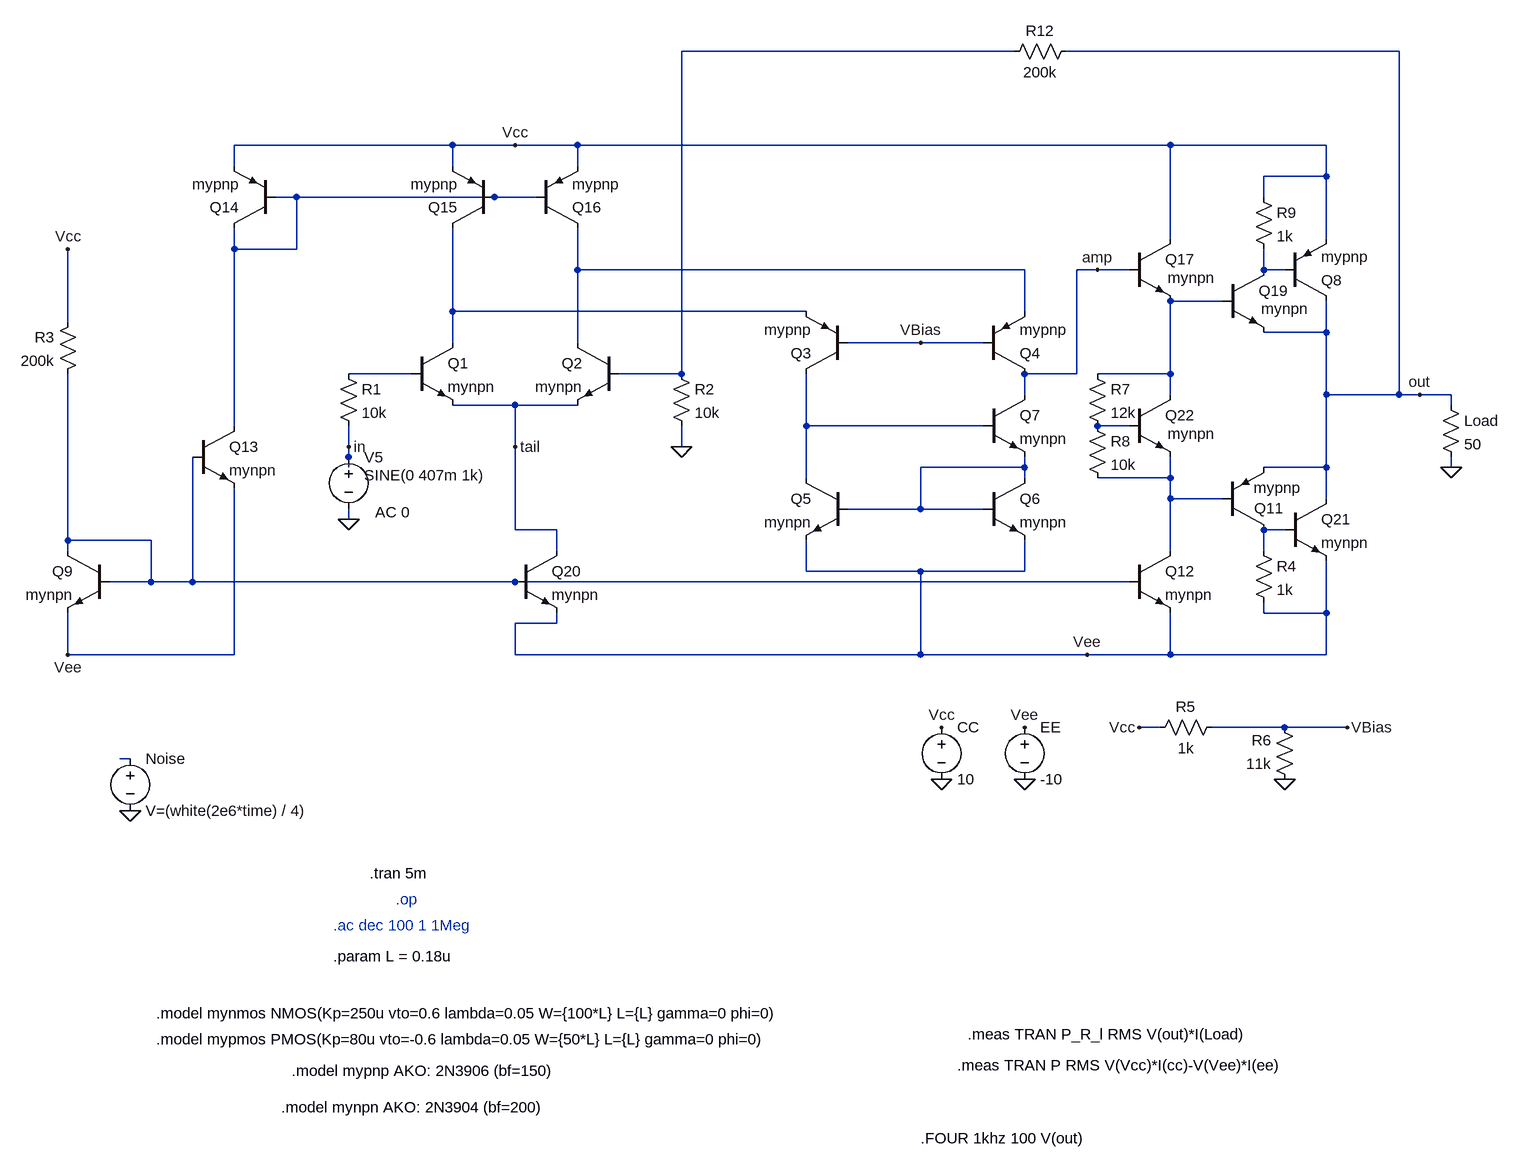
[diagram p0: schematic Ph2.asc]
Ph2.asc, the LTspice schematic file:
Version 4.1
SHEET 1 2180 1464
WIRE 1248 -464 736 -464
WIRE 1840 -464 1328 -464
WIRE 384 -320 48 -320
WIRE 480 -320 384 -320
WIRE 576 -320 480 -320
WIRE 1488 -320 576 -320
WIRE 1728 -320 1488 -320
WIRE 48 -288 48 -320
WIRE 384 -288 384 -320
WIRE 576 -288 576 -320
WIRE 1728 -272 1728 -320
WIRE 1728 -272 1632 -272
WIRE 144 -240 112 -240
WIRE 448 -240 144 -240
WIRE 512 -240 448 -240
WIRE 1632 -240 1632 -272
WIRE 1488 -176 1488 -320
WIRE 1728 -176 1728 -272
WIRE 48 -160 48 -192
WIRE 144 -160 144 -240
WIRE 144 -160 48 -160
WIRE 576 -128 576 -192
WIRE 1264 -128 576 -128
WIRE 1376 -128 1344 -128
WIRE 1424 -128 1376 -128
WIRE 1632 -128 1632 -160
WIRE 1664 -128 1632 -128
WIRE 1568 -80 1488 -80
WIRE 384 -64 384 -192
WIRE 928 -64 384 -64
WIRE 1264 -64 1264 -128
WIRE -208 -48 -208 -160
WIRE 1728 -32 1728 -80
WIRE 1728 -32 1632 -32
WIRE 384 -16 384 -64
WIRE 576 -16 576 -128
WIRE 1104 -16 992 -16
WIRE 1200 -16 1104 -16
WIRE 320 32 224 32
WIRE 736 32 736 -464
WIRE 736 32 640 32
WIRE 1344 32 1344 -128
WIRE 1344 32 1264 32
WIRE 1488 32 1488 -80
WIRE 1488 32 1376 32
WIRE 1264 64 1264 32
WIRE 1488 64 1488 32
WIRE 1728 64 1728 -32
WIRE 1840 64 1840 -464
WIRE 1840 64 1728 64
WIRE 1872 64 1840 64
WIRE 1920 64 1872 64
WIRE 480 80 384 80
WIRE 576 80 480 80
WIRE 1920 80 1920 64
WIRE 48 112 48 -160
WIRE 928 112 928 32
WIRE 1200 112 928 112
WIRE 1424 112 1376 112
WIRE 224 144 224 112
WIRE 480 144 480 80
WIRE 736 144 736 112
WIRE 224 160 224 144
WIRE 224 176 224 160
WIRE 1264 176 1264 160
WIRE 1264 176 1104 176
WIRE 1728 176 1728 64
WIRE 1728 176 1632 176
WIRE 1920 176 1920 160
WIRE 928 192 928 112
WIRE 1264 192 1264 176
WIRE 1488 192 1488 160
WIRE 1488 192 1376 192
WIRE 1488 224 1488 192
WIRE 1568 224 1488 224
WIRE 1728 224 1728 176
WIRE 1104 240 1104 176
WIRE 1104 240 992 240
WIRE 1200 240 1104 240
WIRE 224 256 224 240
WIRE 480 272 480 144
WIRE 544 272 480 272
WIRE 1664 272 1632 272
WIRE -208 288 -208 32
WIRE -80 288 -208 288
WIRE -208 304 -208 288
WIRE 544 304 544 272
WIRE 1488 304 1488 224
WIRE 1632 304 1632 272
WIRE 928 336 928 288
WIRE 1104 336 928 336
WIRE 1264 336 1264 288
WIRE 1264 336 1104 336
WIRE -80 352 -80 288
WIRE -80 352 -144 352
WIRE -16 352 -16 160
WIRE -16 352 -80 352
WIRE 480 352 -16 352
WIRE 1424 352 480 352
WIRE 1632 400 1632 384
WIRE 1728 400 1728 320
WIRE 1728 400 1632 400
WIRE 544 416 544 400
WIRE 544 416 480 416
WIRE -208 464 -208 400
WIRE 48 464 48 208
WIRE 48 464 -208 464
WIRE 480 464 480 416
WIRE 1104 464 1104 336
WIRE 1104 464 480 464
WIRE 1360 464 1104 464
WIRE 1488 464 1488 400
WIRE 1488 464 1360 464
WIRE 1728 464 1728 400
WIRE 1728 464 1488 464
WIRE 1472 576 1440 576
WIRE 1664 576 1552 576
WIRE 1760 576 1664 576
WIRE -112 624 -128 624
FLAG 1136 656 0
FLAG 1264 656 0
FLAG 1136 576 Vcc
FLAG 1264 576 Vee
FLAG 224 256 0
FLAG 480 -320 Vcc
FLAG 1920 176 0
FLAG 1872 64 out
FLAG 1360 464 Vee
FLAG -208 464 Vee
FLAG -208 -160 Vcc
FLAG 1664 656 0
FLAG 1440 576 Vcc
FLAG 1760 576 VBias
FLAG 1104 -16 VBias
FLAG 736 144 0
FLAG 224 144 in
FLAG 480 144 tail
FLAG 1376 -128 amp
FLAG -112 704 0
SYMBOL voltage 1136 560 R0
WINDOW 123 0 0 Left 0
WINDOW 39 0 0 Left 0
SYMATTR InstName CC
SYMATTR Value 10
SYMBOL voltage 1264 560 R0
WINDOW 123 0 0 Left 0
WINDOW 39 0 0 Left 0
SYMATTR InstName EE
SYMATTR Value -10
SYMBOL res 208 16 R0
SYMATTR InstName R1
SYMATTR Value 10k
SYMBOL npn 320 -16 R0
SYMATTR InstName Q1
SYMATTR Value mynpn
SYMBOL npn 640 -16 M0
SYMATTR InstName Q2
SYMATTR Value mynpn
SYMBOL res 720 16 R0
SYMATTR InstName R2
SYMATTR Value 10k
SYMBOL pnp 992 32 R180
SYMATTR InstName Q3
SYMATTR Value mypnp
SYMBOL pnp 1200 32 M180
SYMATTR InstName Q4
SYMATTR Value mypnp
SYMBOL npn 992 192 M0
SYMATTR InstName Q5
SYMATTR Value mynpn
SYMBOL npn 1200 192 R0
SYMATTR InstName Q6
SYMATTR Value mynpn
SYMBOL npn 1200 64 R0
SYMATTR InstName Q7
SYMATTR Value mynpn
SYMBOL res 1904 64 R0
SYMATTR InstName Load
SYMATTR Value 50
SYMBOL npn -144 304 M0
SYMATTR InstName Q9
SYMATTR Value mynpn
SYMBOL res -192 -64 M0
SYMATTR InstName R3
SYMATTR Value 200k
SYMBOL npn 1424 304 R0
SYMATTR InstName Q12
SYMATTR Value mynpn
SYMBOL npn -16 112 R0
SYMATTR InstName Q13
SYMATTR Value mynpn
SYMBOL pnp 112 -192 R180
WINDOW 123 84 4 Left 2
SYMATTR InstName Q14
SYMATTR Value mypnp
SYMBOL pnp 448 -192 R180
WINDOW 123 84 4 Left 2
SYMATTR InstName Q15
SYMATTR Value mypnp
SYMBOL pnp 512 -192 M180
WINDOW 123 84 4 Left 2
SYMATTR InstName Q16
SYMATTR Value mypnp
SYMBOL npn 480 304 R0
SYMATTR InstName Q20
SYMATTR Value mynpn
SYMBOL voltage 224 144 R0
WINDOW 3 24 44 Left 2
WINDOW 123 41 101 Left 2
WINDOW 39 0 0 Left 0
SYMATTR Value SINE(0 407m 1k)
SYMATTR Value2 AC 0
SYMATTR InstName V5
SYMBOL res 1568 560 R90
WINDOW 0 0 56 VBottom 2
WINDOW 3 32 56 VTop 2
SYMATTR InstName R5
SYMATTR Value 1k
SYMBOL res 1680 672 R180
WINDOW 0 36 76 Left 2
WINDOW 3 36 40 Left 2
SYMATTR InstName R6
SYMATTR Value 11k
SYMBOL npn 1568 -128 R0
WINDOW 3 60 60 Left 2
SYMATTR Value mynpn
SYMATTR InstName Q19
SYMBOL pnp 1664 -80 M180
SYMATTR InstName Q8
SYMATTR Value mypnp
SYMBOL pnp 1568 272 M180
WINDOW 0 49 33 Left 2
WINDOW 3 48 65 Left 2
SYMATTR InstName Q11
SYMATTR Value mypnp
SYMBOL npn 1664 224 R0
SYMATTR InstName Q21
SYMATTR Value mynpn
SYMBOL npn 1424 64 R0
WINDOW 3 60 60 Left 2
SYMATTR Value mynpn
SYMATTR InstName Q22
SYMBOL res 1360 16 R0
SYMATTR InstName R7
SYMATTR Value 12k
SYMBOL res 1360 96 R0
SYMATTR InstName R8
SYMATTR Value 10k
SYMBOL res 1616 288 R0
SYMATTR InstName R4
SYMATTR Value 1k
SYMBOL res 1616 -256 R0
SYMATTR InstName R9
SYMATTR Value 1k
SYMBOL res 1344 -480 R90
WINDOW 0 0 56 VBottom 2
WINDOW 3 32 56 VTop 2
SYMATTR InstName R12
SYMATTR Value 200k
SYMBOL npn 1424 -176 R0
WINDOW 3 60 60 Left 2
SYMATTR Value mynpn
SYMATTR InstName Q17
SYMBOL voltage -112 608 R0
SYMATTR InstName Noise
SYMATTR Value V=(white(2e6*time) / 4)
SYMATTR Prefix B
TEXT 200 928 Left 2 !.param L = 0.18u
TEXT -72 1016 Left 2 !.model mynmos NMOS(Kp=250u vto=0.6 lambda=0.05 W={100*L} L={L} gamma=0 phi=0)
TEXT -72 1056 Left 2 !.model mypmos PMOS(Kp=80u vto=-0.6 lambda=0.05 W={50*L} L={L} gamma=0 phi=0)
TEXT 136 1104 Left 2 !.model mypnp AKO: 2N3906 (bf=150)
TEXT 120 1160 Left 2 !.model mynpn AKO: 2N3904 (bf=200)
TEXT 296 840 Left 2 ;.op
TEXT 200 880 Left 2 ;.ac dec 100 1 1Meg
TEXT 256 800 Left 2 !.tran 5m
TEXT 1160 1096 Left 2 !.meas TRAN P RMS V(Vcc)*I(cc)-V(Vee)*I(ee)
TEXT 1104 1208 Left 2 !.FOUR 1khz 100 V(out)
TEXT 1176 1048 Left 2 !.meas TRAN P_R_l RMS V(out)*I(Load)

The netlist it stands for:
* Ph2.asc
V§CC Vcc 0 10
V§EE Vee 0 -10
R1 N007 in 10k
Q1 N006 N007 tail 0 mynpn
Q2 N003 N001 tail 0 mynpn
R2 N001 0 10k
Q3 N008 VBias N006 0 mypnp
Q4 amp VBias N003 0 mypnp
Q5 N008 N010 Vee 0 mynpn
Q6 N010 N010 Vee 0 mynpn
Q7 amp N008 N010 0 mynpn
R§Load out 0 50
Q9 N013 N013 Vee 0 mynpn
R3 Vcc N013 200k
Q12 N011 N013 Vee 0 mynpn
Q13 N002 N013 Vee 0 mynpn
Q14 N002 N002 Vcc 0 mypnp
Q15 N006 N002 Vcc 0 mypnp
Q16 N003 N002 Vcc 0 mypnp
Q20 tail N013 Vee 0 mynpn
V5 in 0 SINE(0 407m 1k) AC 0
R5 VBias Vcc 1k
R6 0 VBias 11k
Q19 N004 N005 out 0 mynpn
Q8 out N004 Vcc 0 mypnp
Q11 N012 N011 out 0 mypnp
Q21 out N012 Vee 0 mynpn
Q22 N005 N009 N011 0 mynpn
R7 N005 N009 12k
R8 N009 N011 10k
R4 N012 Vee 1k
R9 Vcc N004 1k
R12 out N001 200k
Q17 Vcc amp N005 0 mynpn
B§Noise N014 0 V=(white(2e6*time) / 4)
.model NPN NPN
.model PNP PNP
.lib standard.bjt
.param L = 0.18u
.model mynmos NMOS(Kp=250u vto=0.6 lambda=0.05 W={100*L} L={L} gamma=0 phi=0)
.model mypmos PMOS(Kp=80u vto=-0.6 lambda=0.05 W={50*L} L={L} gamma=0 phi=0)
.model mypnp AKO: 2N3906 (bf=150)
.model mynpn AKO: 2N3904 (bf=200)
* .op
* .ac dec 100 1 1Meg
.tran 5m
.meas TRAN P RMS V(Vcc)*I(cc)-V(Vee)*I(ee)
.FOUR 1khz 100 V(out)
.meas TRAN P_R_l RMS V(out)*I(Load)
.backanno
.end